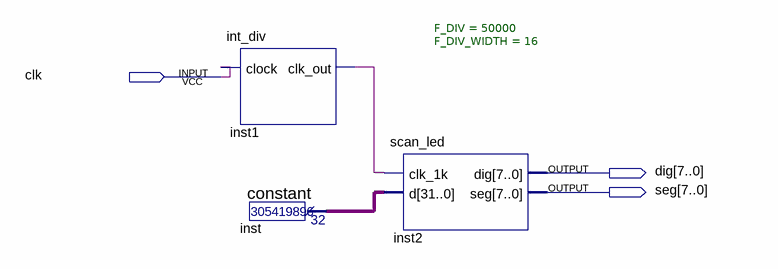
[diagram p0: schematic sheet]
// Quartus schematic dled.bdf as structural Verilog: 3 symbols, 3 pins
module dled (
  input  clk,
  output [7:0] dig,
  output [7:0] seg
);

  wire inst1_clk_out;
  wire [31:0] inst_result;

  int_div #(.F_DIV(50000), .F_DIV_WIDTH(16)) inst1 (.clock(clk), .clk_out(inst1_clk_out));
  constant inst (.result(inst_result));
  scan_led inst2 (.clk_1k(inst1_clk_out), .d(inst_result), .dig(dig), .seg(seg));
endmodule
